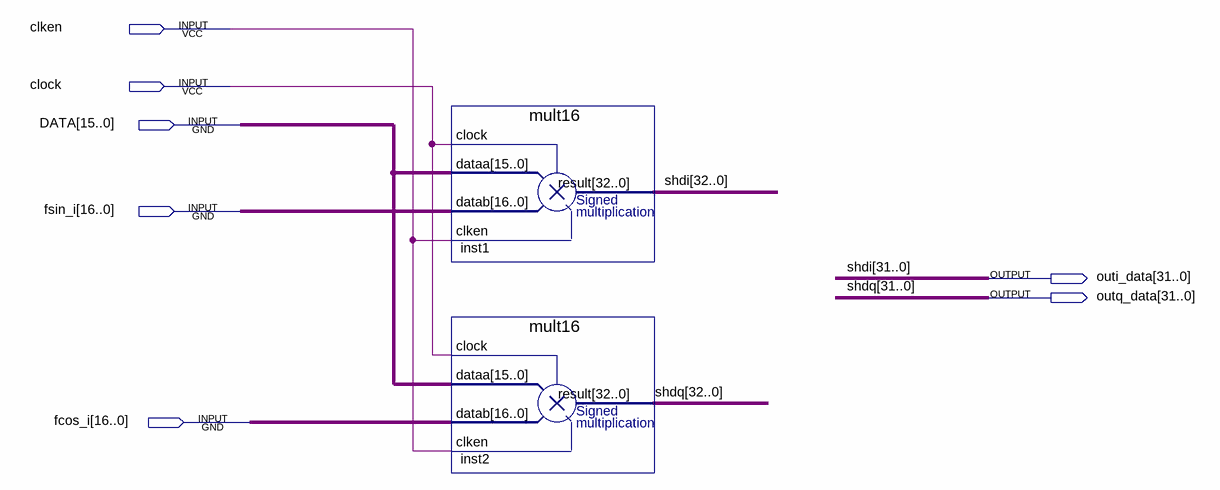
[diagram p0: schematic sheet]
// Quartus schematic ddc_mux.bdf as structural Verilog: 2 symbols, 7 pins
module ddc_mux (
  input  clken,
  input  clock,
  input  [15:0] DATA,
  input  [16:0] fsin_i,
  input  [16:0] fcos_i,
  output [31:0] outi_data,
  output [31:0] outq_data
);

  wire [32:32] shdi, shdq;

  mult16 inst1 (.clock(clock), .dataa(DATA), .datab(fsin_i), .clken(clken), .result({shdi[32], outi_data}));
  mult16 inst2 (.clock(clock), .dataa(DATA), .datab(fcos_i), .clken(clken), .result({shdq[32], outq_data}));

  // Other names for the same wires on the sheet: shdi[31:0] = outi_data; shdq[31:0] = outq_data
endmodule
